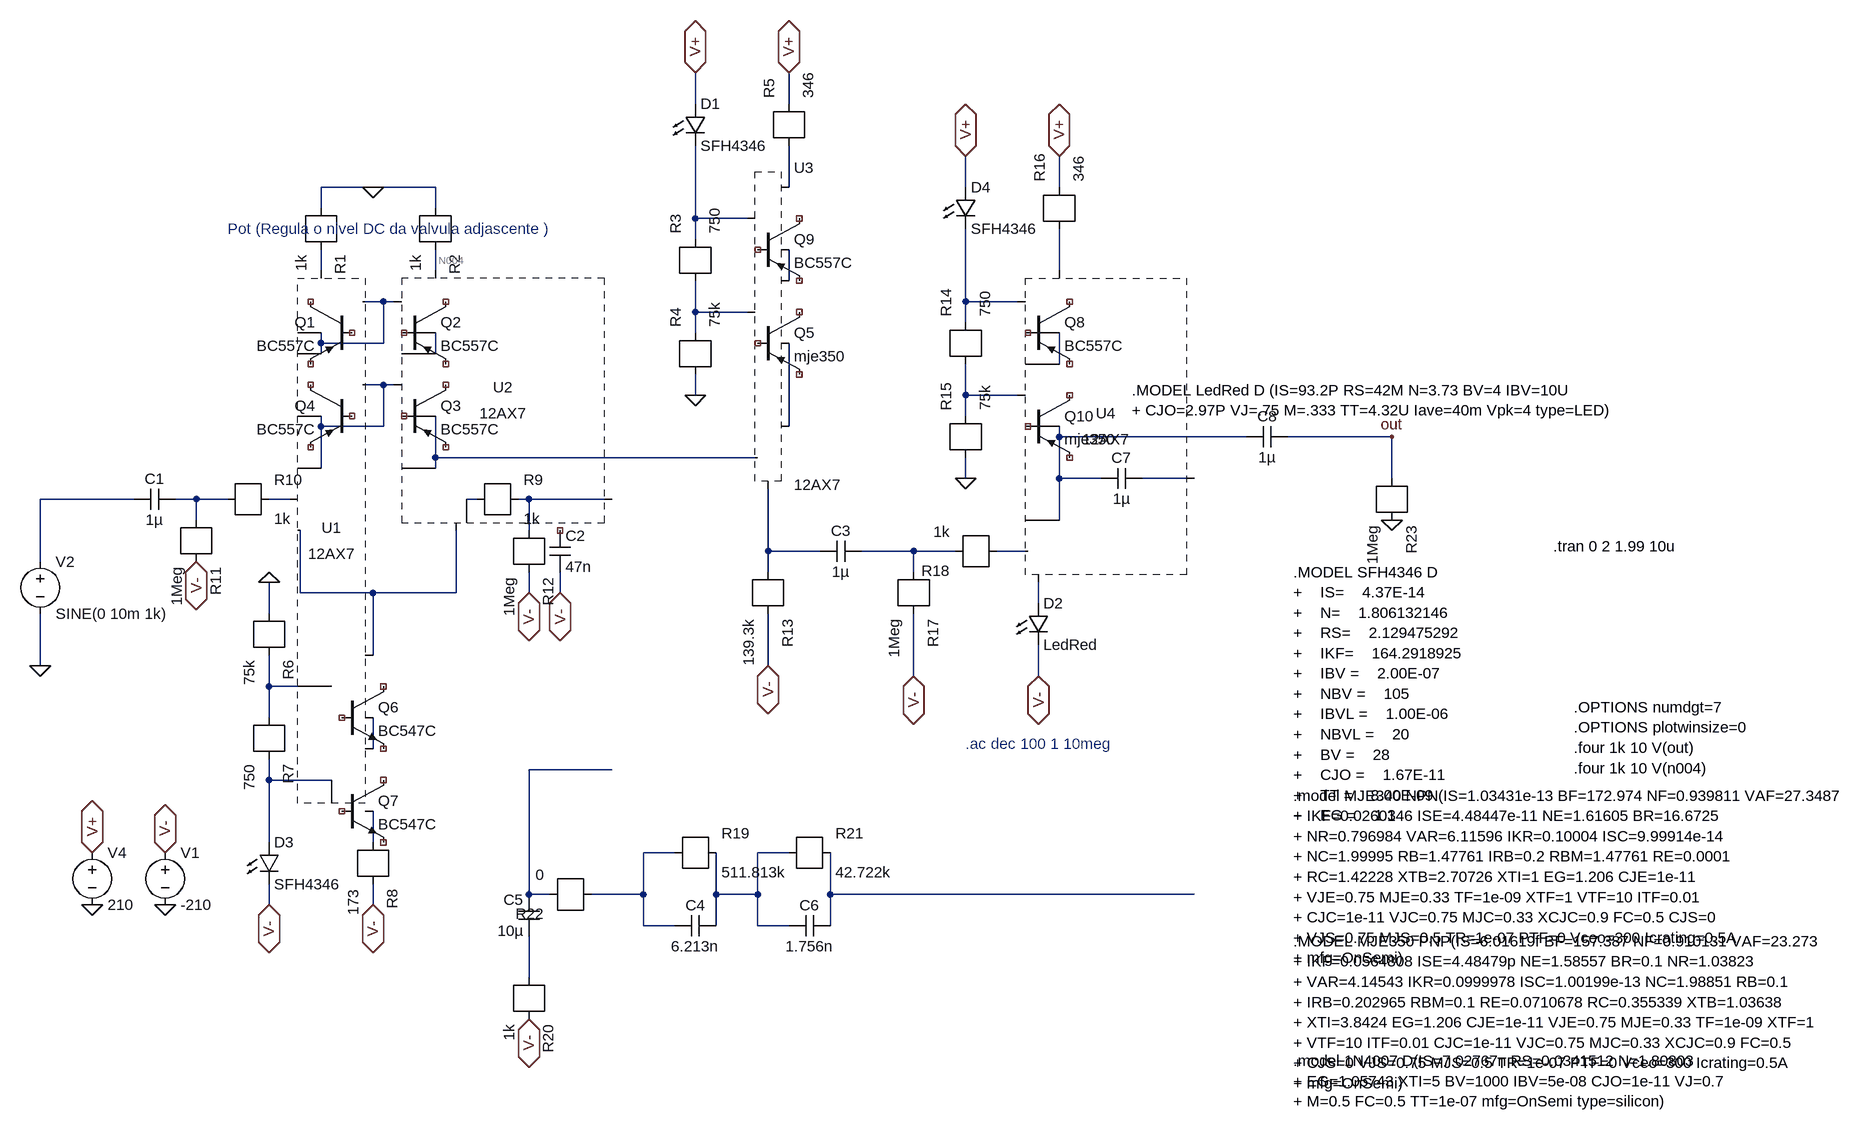
[diagram p0: schematic pre_tcc_diferencial.asc]
pre_tcc_diferencial.asc, the LTspice schematic file:
Version 4
SHEET 1 4724 1424
WIRE 848 -288 848 -336
WIRE 992 -288 992 -336
WIRE 352 -160 272 -160
WIRE 448 -160 352 -160
WIRE 992 -160 992 -224
WIRE 1264 -160 1264 -208
WIRE 1408 -160 1408 -208
WIRE 272 -128 272 -160
WIRE 448 -128 448 -160
WIRE 848 -112 848 -224
WIRE 928 -112 848 -112
WIRE 848 -80 848 -112
WIRE 272 -32 272 -64
WIRE 448 -32 448 -64
WIRE 1408 -32 1408 -96
WIRE 992 -16 992 -64
WIRE 368 16 336 16
WIRE 384 16 368 16
WIRE 1264 16 1264 -96
WIRE 1344 16 1264 16
WIRE 848 32 848 -16
WIRE 928 32 848 32
WIRE 1264 48 1264 16
WIRE 848 64 848 32
WIRE 272 80 272 64
WIRE 368 80 368 16
WIRE 368 80 272 80
WIRE 272 96 272 80
WIRE 448 96 448 64
WIRE 1408 112 1408 64
WIRE 368 144 336 144
WIRE 384 144 368 144
WIRE 848 160 848 128
WIRE 1264 160 1264 112
WIRE 1344 160 1264 160
WIRE 1264 192 1264 160
WIRE 272 208 272 192
WIRE 368 208 368 144
WIRE 368 208 272 208
WIRE 992 208 992 80
WIRE 1408 224 1408 208
WIRE 1696 224 1408 224
WIRE 1920 224 1760 224
WIRE 448 256 448 192
WIRE 944 256 448 256
WIRE 272 272 272 208
WIRE 448 272 448 256
WIRE 1264 288 1264 256
WIRE 1408 288 1408 224
WIRE 1472 288 1408 288
WIRE 1616 288 1536 288
WIRE 1920 288 1920 224
WIRE -16 320 -160 320
WIRE 80 320 48 320
WIRE 128 320 80 320
WIRE 224 320 192 320
WIRE 512 320 496 320
WIRE 592 320 576 320
WIRE 720 320 592 320
WIRE 80 352 80 320
WIRE 1408 352 1408 288
WIRE 592 368 592 320
WIRE 960 400 960 304
WIRE 1040 400 960 400
WIRE 1184 400 1104 400
WIRE 1248 400 1184 400
WIRE 1360 400 1312 400
WIRE -160 416 -160 320
WIRE 960 432 960 400
WIRE 1184 432 1184 400
WIRE 240 464 240 368
WIRE 352 464 240 464
WIRE 480 464 480 368
WIRE 480 464 352 464
WIRE 592 464 592 432
WIRE 640 464 640 432
WIRE 1376 480 1376 448
WIRE 192 496 192 448
WIRE 352 560 352 464
WIRE -160 576 -160 496
WIRE 960 576 960 496
WIRE 1184 592 1184 496
WIRE 1376 592 1376 544
WIRE 192 608 192 560
WIRE 288 608 192 608
WIRE 192 656 192 608
WIRE 352 704 352 656
WIRE 720 736 592 736
WIRE 192 752 192 720
WIRE 288 752 192 752
WIRE 192 848 192 752
WIRE 352 848 352 800
WIRE 816 864 768 864
WIRE 992 864 944 864
WIRE 592 928 592 736
WIRE 624 928 592 928
WIRE 768 928 768 864
WIRE 768 928 688 928
WIRE 880 928 880 864
WIRE 944 928 944 864
WIRE 944 928 880 928
WIRE 1056 928 1056 864
WIRE 1616 928 1056 928
WIRE 192 944 192 912
WIRE 352 944 352 912
WIRE 768 976 768 928
WIRE 816 976 768 976
WIRE 880 976 880 928
WIRE 944 976 944 928
WIRE 992 976 944 976
WIRE 1056 976 1056 928
WIRE 592 1056 592 992
FLAG -160 576 0
FLAG 192 448 0
FLAG -80 864 V+
IOPIN -80 864 BiDir
FLAG 32 864 V-
IOPIN 32 864 BiDir
FLAG 32 944 0
FLAG -80 944 0
FLAG 352 944 V-
IOPIN 352 944 BiDir
FLAG 192 944 V-
IOPIN 192 944 BiDir
FLAG 352 -160 0
FLAG 80 416 V-
IOPIN 80 416 BiDir
FLAG 592 464 V-
IOPIN 592 464 BiDir
FLAG 640 464 V-
IOPIN 640 464 BiDir
FLAG 848 160 0
FLAG 992 -336 V+
IOPIN 992 -336 BiDir
FLAG 848 -336 V+
IOPIN 848 -336 BiDir
FLAG 960 576 V-
IOPIN 960 576 BiDir
FLAG 1376 592 V-
IOPIN 1376 592 BiDir
FLAG 1184 592 V-
IOPIN 1184 592 BiDir
FLAG 1264 288 0
FLAG 1408 -208 V+
IOPIN 1408 -208 BiDir
FLAG 1264 -208 V+
IOPIN 1264 -208 BiDir
FLAG 1920 224 out
FLAG 592 1120 V-
IOPIN 592 1120 BiDir
FLAG 1920 352 0
SYMBOL NormanKoren/12AX7 272 320 R0
SYMATTR InstName U1
SYMBOL NormanKoren/12AX7 448 320 M0
SYMATTR InstName U2
SYMBOL pnp 320 16 M0
SYMATTR InstName Q1
SYMATTR Value BC557C
SYMBOL pnp 400 16 R0
SYMATTR InstName Q2
SYMATTR Value BC557C
SYMBOL voltage -160 400 R0
SYMATTR InstName V2
SYMATTR Value SINE(0 10m 1k)
SYMATTR Value2 AC 1
SYMBOL cap 48 304 R90
WINDOW 0 0 32 VBottom 2
WINDOW 3 32 32 VTop 2
SYMATTR InstName C1
SYMATTR Value 1µ
SYMBOL r 272 -128 R90
SYMATTR InstName R1
SYMATTR Value 1k
SYMBOL r 448 -128 R90
SYMATTR InstName R2
SYMATTR Value 1k
SYMBOL pnp 400 144 R0
SYMATTR InstName Q3
SYMATTR Value BC557C
SYMBOL pnp 320 144 M0
SYMATTR InstName Q4
SYMATTR Value BC557C
SYMBOL NormanKoren/12AX7 992 256 R0
SYMATTR InstName U3
SYMBOL voltage -80 848 R0
SYMATTR InstName V4
SYMATTR Value 210
SYMBOL LED 176 848 R0
SYMATTR InstName D3
SYMATTR Value SFH4346
SYMBOL r 192 496 R90
SYMATTR InstName R6
SYMATTR Value 75k
SYMBOL r 192 656 R90
SYMATTR InstName R7
SYMATTR Value 750
SYMBOL r 352 848 R90
SYMATTR InstName R8
SYMATTR Value 173
SYMBOL npn 304 608 R0
SYMATTR InstName Q6
SYMATTR Value BC547C
SYMBOL npn 304 752 R0
SYMATTR InstName Q7
SYMATTR Value BC547C
SYMBOL voltage 32 848 R0
SYMATTR InstName V1
SYMATTR Value -210
SYMBOL r 512 320 R0
SYMATTR InstName R9
SYMATTR Value 1k
SYMBOL r 128 320 R0
SYMATTR InstName R10
SYMATTR Value 1k
SYMBOL r 80 352 R90
SYMATTR InstName R11
SYMATTR Value 1Meg
SYMBOL r 592 368 R90
SYMATTR InstName R12
SYMATTR Value 1Meg
SYMBOL cap 624 368 R0
SYMATTR InstName C2
SYMATTR Value 47n
SYMBOL r 848 -16 R270
SYMATTR InstName R3
SYMATTR Value 750
SYMBOL r 848 128 R270
SYMATTR InstName R4
SYMATTR Value 75k
SYMBOL r 992 -224 R270
SYMATTR InstName R5
SYMATTR Value 346
SYMBOL LED 832 -288 R0
SYMATTR InstName D1
SYMATTR Value SFH4346
SYMBOL pnp 944 -112 R0
SYMATTR InstName Q9
SYMATTR Value BC557C
SYMBOL pnp 944 32 R0
SYMATTR InstName Q5
SYMATTR Value mje350
SYMBOL r 960 432 R90
SYMATTR InstName R13
SYMATTR Value 139.3k
SYMBOL NormanKoren/12AX7 1408 400 R0
SYMATTR InstName U4
SYMBOL LED 1360 480 R0
SYMATTR InstName D2
SYMATTR Value LedRed
SYMBOL r 1264 112 R270
SYMATTR InstName R14
SYMATTR Value 750
SYMBOL r 1264 256 R270
SYMATTR InstName R15
SYMATTR Value 75k
SYMBOL r 1408 -96 R270
SYMATTR InstName R16
SYMATTR Value 346
SYMBOL LED 1248 -160 R0
SYMATTR InstName D4
SYMATTR Value SFH4346
SYMBOL pnp 1360 16 R0
SYMATTR InstName Q8
SYMATTR Value BC557C
SYMBOL pnp 1360 160 R0
SYMATTR InstName Q10
SYMATTR Value mje350
SYMBOL r 1184 432 R90
SYMATTR InstName R17
SYMATTR Value 1Meg
SYMBOL r 1312 400 R180
SYMATTR InstName R18
SYMATTR Value 1k
SYMBOL cap 1104 384 R90
WINDOW 0 0 32 VBottom 2
WINDOW 3 32 32 VTop 2
SYMATTR InstName C3
SYMATTR Value 1µ
SYMBOL cap 880 960 R90
WINDOW 0 0 32 VBottom 2
WINDOW 3 32 32 VTop 2
SYMATTR InstName C4
SYMATTR Value 6.213n
SYMBOL r 816 864 R0
SYMATTR InstName R19
SYMATTR Value 511.813k
SYMBOL r 592 1056 R90
SYMATTR InstName R20
SYMATTR Value 1k
SYMBOL cap 608 992 R180
WINDOW 0 24 56 Left 2
WINDOW 3 24 8 Left 2
SYMATTR InstName C5
SYMATTR Value 10µ
SYMBOL cap 1056 960 R90
WINDOW 0 0 32 VBottom 2
WINDOW 3 32 32 VTop 2
SYMATTR InstName C6
SYMATTR Value 1.756n
SYMBOL r 992 864 R0
SYMATTR InstName R21
SYMATTR Value 42.722k
SYMBOL r 688 928 R180
SYMATTR InstName R22
SYMATTR Value 0
SYMBOL cap 1536 272 R90
WINDOW 0 0 32 VBottom 2
WINDOW 3 32 32 VTop 2
SYMATTR InstName C7
SYMATTR Value 1µ
SYMBOL cap 1760 208 R90
WINDOW 0 0 32 VBottom 2
WINDOW 3 32 32 VTop 2
SYMATTR InstName C8
SYMATTR Value 1µ
SYMBOL r 1920 288 R90
SYMATTR InstName R23
SYMATTR Value 1Meg
TEXT 2168 392 Left 2 !.tran 0 2 1.99 10u
TEXT 2200 640 Left 2 !.OPTIONS numdgt=7\n.OPTIONS plotwinsize=0\n.four 1k 10 V(out)\n.four 1k 10 V(n004)
TEXT 1768 432 Left 2 !.MODEL SFH4346 D	\n+	IS=	4.37E-14\n+	N=	1.806132146\n+	RS=	2.129475292\n+	IKF=	164.2918925\n+	IBV =	2.00E-07\n+	NBV =	105\n+	IBVL =	1.00E-06\n+	NBVL =	20\n+	BV =	28\n+	CJO =	1.67E-11\n+	TT =	8.00E-09\n+	EG =	1.3
TEXT 1264 696 Left 2 ;.ac dec 100 1 10meg
TEXT 128 -96 Left 2 ;Pot (Regula o nivel DC da valvula adjascente )
TEXT 1768 776 Left 2 !.model MJE340 NPN(IS=1.03431e-13 BF=172.974 NF=0.939811 VAF=27.3487\n+ IKF=0.0260146 ISE=4.48447e-11 NE=1.61605 BR=16.6725\n+ NR=0.796984 VAR=6.11596 IKR=0.10004 ISC=9.99914e-14\n+ NC=1.99995 RB=1.47761 IRB=0.2 RBM=1.47761 RE=0.0001\n+ RC=1.42228 XTB=2.70726 XTI=1 EG=1.206 CJE=1e-11\n+ VJE=0.75 MJE=0.33 TF=1e-09 XTF=1 VTF=10 ITF=0.01\n+ CJC=1e-11 VJC=0.75 MJC=0.33 XCJC=0.9 FC=0.5 CJS=0\n+ VJS=0.75 MJS=0.5 TR=1e-07 PTF=0 Vceo=300 Icrating=0.5A\n+ mfg=OnSemi)
TEXT 1768 1000 Left 2 !.MODEL MJE350 PNP(IS=6.01619f BF=157.387 NF=0.910131 VAF=23.273\n+ IKF=0.0564808 ISE=4.48479p NE=1.58557 BR=0.1 NR=1.03823\n+ VAR=4.14543 IKR=0.0999978 ISC=1.00199e-13 NC=1.98851 RB=0.1\n+ IRB=0.202965 RBM=0.1 RE=0.0710678 RC=0.355339 XTB=1.03638\n+ XTI=3.8424 EG=1.206 CJE=1e-11 VJE=0.75 MJE=0.33 TF=1e-09 XTF=1\n+ VTF=10 ITF=0.01 CJC=1e-11 VJC=0.75 MJC=0.33 XCJC=0.9 FC=0.5\n+ CJS=0 VJS=0.75 MJS=0.5 TR=1e-07 PTF=0 Vceo=300 Icrating=0.5A\n+ mfg=OnSemi)
TEXT 1768 1184 Left 2 !.model 1N4007 D(IS=7.02767n RS=0.0341512 N=1.80803 \n+ EG=1.05743 XTI=5 BV=1000 IBV=5e-08 CJO=1e-11 VJ=0.7 \n+ M=0.5 FC=0.5 TT=1e-07 mfg=OnSemi type=silicon)
TEXT 1520 152 Left 2 !.MODEL LedRed D (IS=93.2P RS=42M N=3.73 BV=4 IBV=10U \n+ CJO=2.97P VJ=.75 M=.333 TT=4.32U Iave=40m Vpk=4 type=LED)

The netlist it stands for:
* pre_tcc_diferencial.asc
* U1: 12AX7 (symbol NormanKoren/12AX7 not available, pin order unknown); nets seen at it: N003, N007, N012, N020, N026, N028, N029, N031, N032
* U2: 12AX7 (symbol NormanKoren/12AX7 not available, pin order unknown); nets seen at it: N004, N007, N010, N012, N016, N021, N022, N026
Q1 NC_01 NC_02 NC_03 0 BC557C
Q2 NC_04 NC_05 NC_06 0 BC557C
V2 N018 0 SINE(0 10m 1k) AC 1
C1 N019 N018 1µ
R1 N003 0 1k
R2 N004 0 1k
Q3 NC_07 NC_08 NC_09 0 BC557C
Q4 NC_10 NC_11 NC_12 0 BC557C
* U3: 12AX7 (symbol NormanKoren/12AX7 not available, pin order unknown); nets seen at it: N001, N002, N006, N009, N014, N016, N023
V4 V+ 0 210
D3 N031 V- SFH4346
R6 N028 0 75k
R7 N031 N028 750
R8 V- N032 173
Q6 NC_13 NC_14 NC_15 0 BC547C
Q7 NC_16 NC_17 NC_18 0 BC547C
V1 V- 0 -210
R9 N022 N021 1k
R10 N020 N019 1k
R11 V- N019 1Meg
R12 V- N022 1Meg
C2 NC_19 V- 47n
R3 N002 N009 750
R4 N009 0 75k
R5 V+ N001 346
D1 V+ N002 SFH4346
Q9 NC_20 NC_21 NC_22 0 BC557C
Q5 NC_23 NC_24 NC_25 0 mje350
R13 V- N023 139.3k
* U4: 12AX7 (symbol NormanKoren/12AX7 not available, pin order unknown); nets seen at it: N005, N008, N011, N013, N015, N017, N025, N027
D2 N027 V- LedRed
R14 N008 N013 750
R15 N013 0 75k
R16 V+ N005 346
D4 V+ N008 SFH4346
Q8 NC_26 NC_27 NC_28 0 BC557C
Q10 NC_29 NC_30 NC_31 0 mje350
R17 V- N024 1Meg
R18 N024 N025 1k
C3 N024 N023 1µ
C4 N034 N033 6.213n
R19 N034 N033 511.813k
R20 V- N036 1k
C5 N036 N030 10µ
C6 N035 N034 1.756n
R21 N035 N034 42.722k
R22 N030 N033 0
C7 N017 N015 1µ
C8 out N015 1µ
R23 0 out 1Meg
.model D D
.lib standard.dio
.model NPN NPN
.model PNP PNP
.lib standard.bjt
.tran 0 2 1.99 10u
.OPTIONS numdgt=7
.OPTIONS plotwinsize=0
.four 1k 10 V(out)
.four 1k 10 V(n004)
.MODEL SFH4346 D
+	IS=	4.37E-14
+	N=	1.806132146
+	RS=	2.129475292
+	IKF=	164.2918925
+	IBV =	2.00E-07
+	NBV =	105
+	IBVL =	1.00E-06
+	NBVL =	20
+	BV =	28
+	CJO =	1.67E-11
+	TT =	8.00E-09
+	EG =	1.3
* .ac dec 100 1 10meg
* Pot (Regula o nivel DC da valvula adjascente )
.model MJE340 NPN(IS=1.03431e-13 BF=172.974 NF=0.939811 VAF=27.3487
+ IKF=0.0260146 ISE=4.48447e-11 NE=1.61605 BR=16.6725
+ NR=0.796984 VAR=6.11596 IKR=0.10004 ISC=9.99914e-14
+ NC=1.99995 RB=1.47761 IRB=0.2 RBM=1.47761 RE=0.0001
+ RC=1.42228 XTB=2.70726 XTI=1 EG=1.206 CJE=1e-11
+ VJE=0.75 MJE=0.33 TF=1e-09 XTF=1 VTF=10 ITF=0.01
+ CJC=1e-11 VJC=0.75 MJC=0.33 XCJC=0.9 FC=0.5 CJS=0
+ VJS=0.75 MJS=0.5 TR=1e-07 PTF=0 Vceo=300 Icrating=0.5A
+ mfg=OnSemi)
.MODEL MJE350 PNP(IS=6.01619f BF=157.387 NF=0.910131 VAF=23.273
+ IKF=0.0564808 ISE=4.48479p NE=1.58557 BR=0.1 NR=1.03823
+ VAR=4.14543 IKR=0.0999978 ISC=1.00199e-13 NC=1.98851 RB=0.1
+ IRB=0.202965 RBM=0.1 RE=0.0710678 RC=0.355339 XTB=1.03638
+ XTI=3.8424 EG=1.206 CJE=1e-11 VJE=0.75 MJE=0.33 TF=1e-09 XTF=1
+ VTF=10 ITF=0.01 CJC=1e-11 VJC=0.75 MJC=0.33 XCJC=0.9 FC=0.5
+ CJS=0 VJS=0.75 MJS=0.5 TR=1e-07 PTF=0 Vceo=300 Icrating=0.5A
+ mfg=OnSemi)
.model 1N4007 D(IS=7.02767n RS=0.0341512 N=1.80803
+ EG=1.05743 XTI=5 BV=1000 IBV=5e-08 CJO=1e-11 VJ=0.7
+ M=0.5 FC=0.5 TT=1e-07 mfg=OnSemi type=silicon)
.MODEL LedRed D (IS=93.2P RS=42M N=3.73 BV=4 IBV=10U
+ CJO=2.97P VJ=.75 M=.333 TT=4.32U Iave=40m Vpk=4 type=LED)
.backanno
.end